# Altium project MAX14871_DC_Motor_Driver.PrjPcb (part 1 of 3)
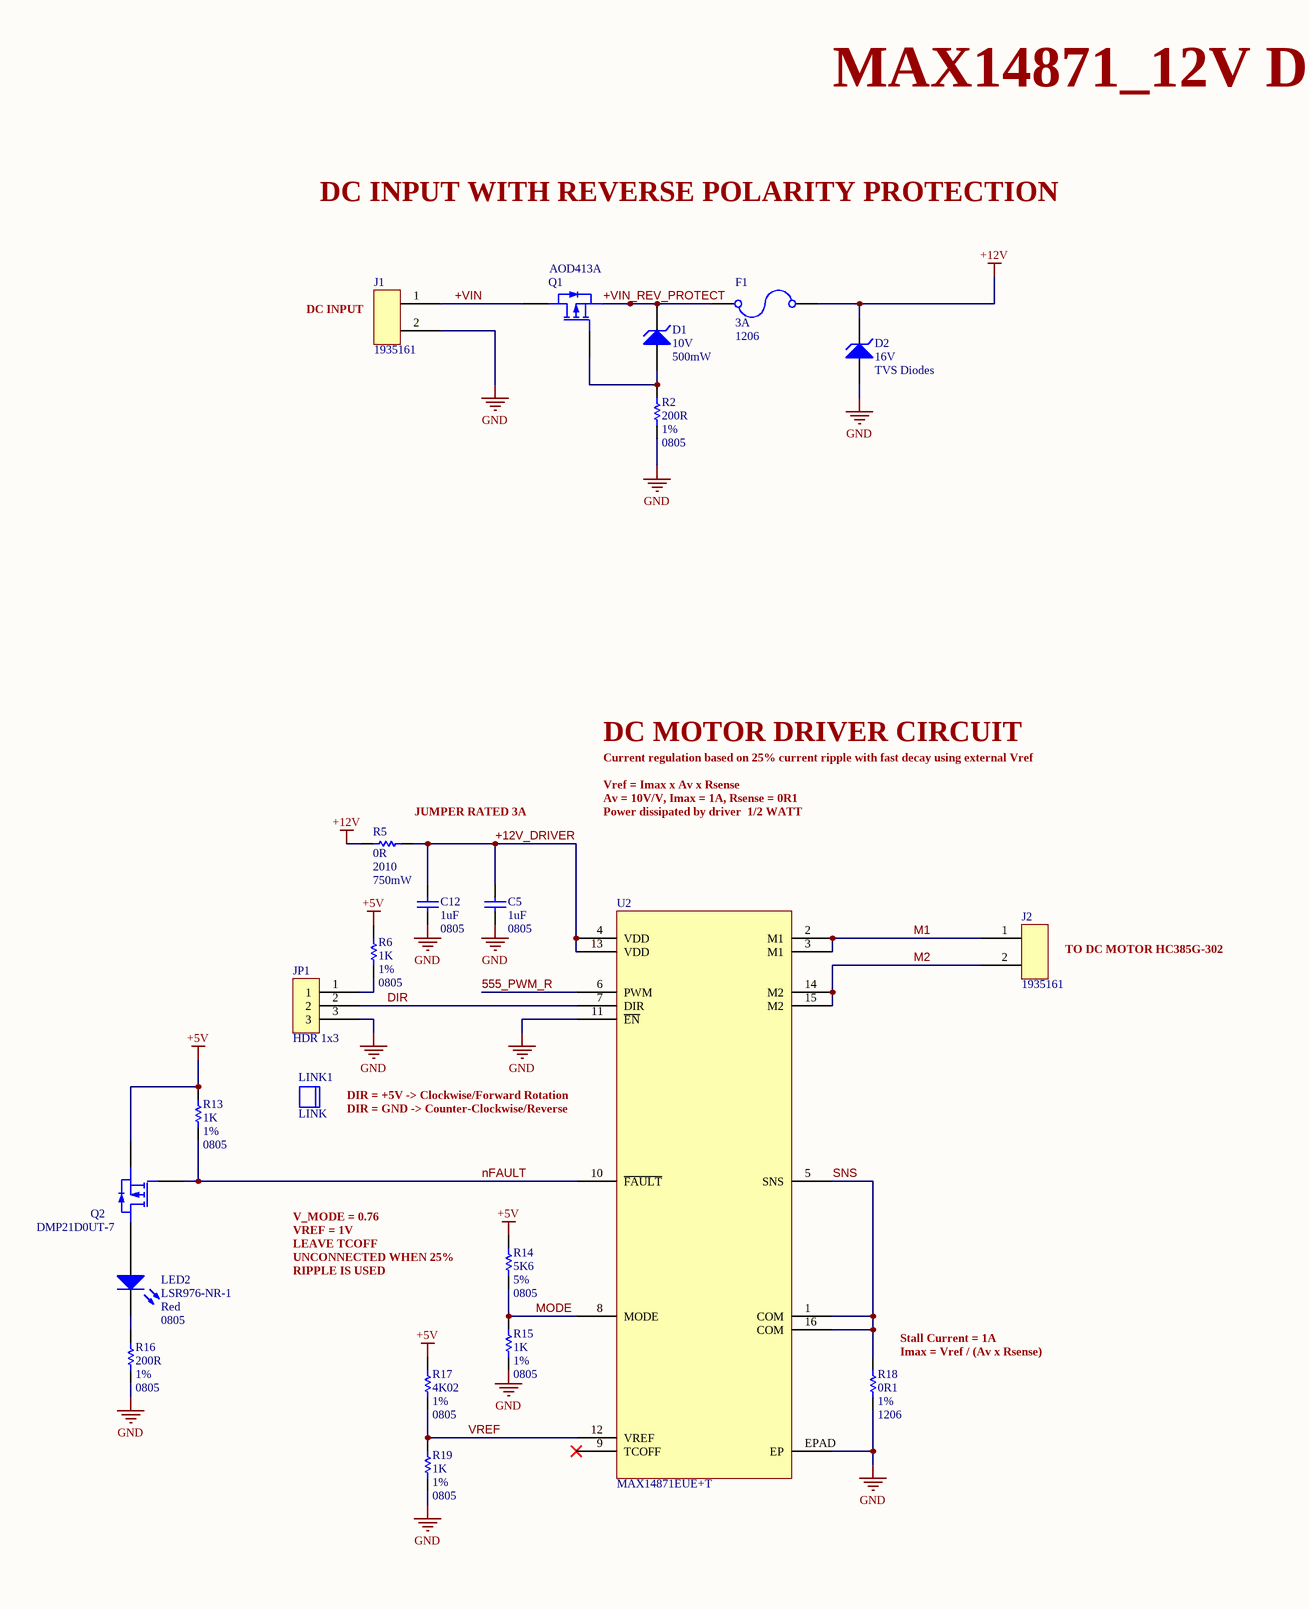
[diagram p0: 14871_Schematic.SchDoc, left]
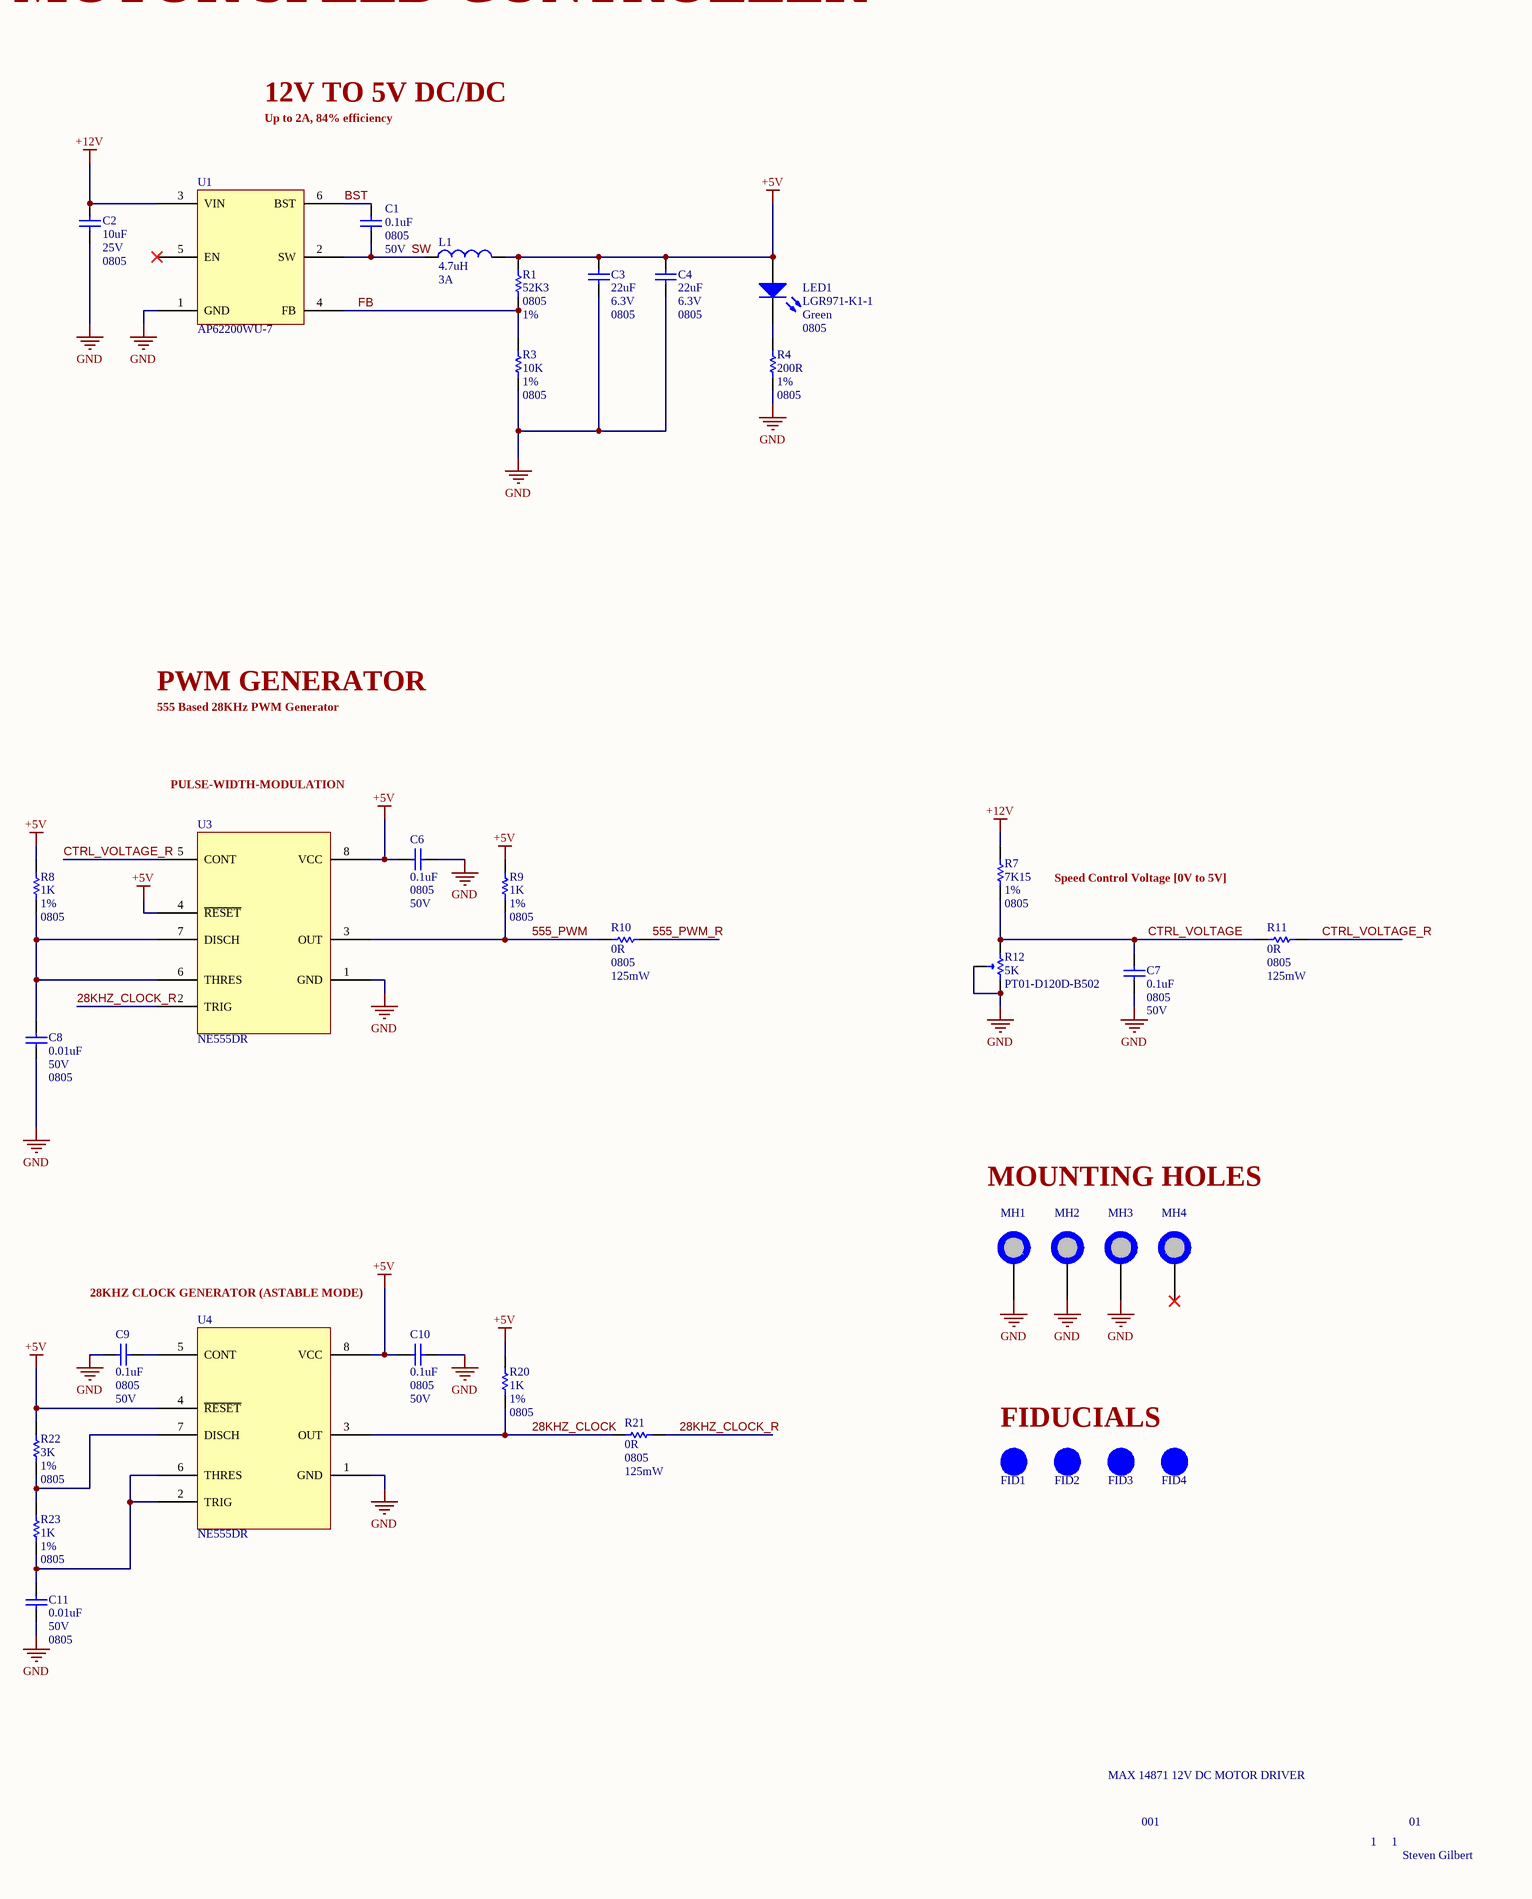
[diagram p1: 14871_Schematic.SchDoc, right]
1 sheet, 59 parts. Net scope: global (net labels, ports and power ports of the same name join across sheets).
Board file: 14871_V1I1.PcbDoc

## Sheet 14871_Schematic.SchDoc
size A2

### Parts
C1  0.1uF  Case Code (Imperial): 0805  Voltage Rating (DC): 50V  [C0805]
C2  10uF  Voltage Rating (DC): 25V  Case/Package: 0805  [C0805]
C3  22uF  Voltage Rating: 6.3V  Case/Package: 0805  [C0805]
C4  22uF  Voltage Rating: 6.3V  Case/Package: 0805  [C0805]
C5  1uF  Case/Package: 0805  [C0805]
C6  0.1uF  Case Code (Imperial): 0805  Voltage Rating (DC): 50V  [C0805]
C7  0.1uF  Case Code (Imperial): 0805  Voltage Rating (DC): 50V  [C0805]
C8  0.01uF  Voltage Rating: 50V  Case/Package: 0805  [C0805]
C9  0.1uF  Case Code (Imperial): 0805  Voltage Rating (DC): 50V  [C0805]
C10  0.1uF  Case Code (Imperial): 0805  Voltage Rating (DC): 50V  [C0805]
C11  0.01uF  Voltage Rating: 50V  Case/Package: 0805  [C0805]
C12  1uF  Case/Package: 0805  [C0805]
D1  10V  Max Power Dissipation: 500mW  [SOD123_Zener]
D2  16V  Category: TVS Diodes  [TVS_SOD123FL]
F1  3A  Case/Package: 1206  [FUSE1206]
FID1  FID_1MM  [FID_40X120D]  (value not drawn)  (no BOM)
FID2  FID_1MM  [FID_40X120D]  (value not drawn)  (no BOM)
FID3  FID_1MM  [FID_40X120D]  (value not drawn)  (no BOM)
FID4  FID_1MM  [FID_40X120D]  (value not drawn)  (no BOM)
J1  1935161  [1935161]
J2  1935161  [1935161]
JP1  HDR 1x3  [HDR_1x3_2.54mm]
L1  4.7uH  Max DC Current: 3A  [NR6028T4R7M]
LED1  LGR971-K1-1  Illumination Color: Green  Case/Package: 0805  [LED0805 - Green]
LED2  LSR976-NR-1  Illumination Color: Red  Case/Package: 0805  [LED0805]
LINK1  LINK  (mechanical)
MH1  MH_7.4MMC_3.2MMD  [MH_7.4MMC_3.2MMD]  (value not drawn)  (no BOM)
MH2  MH_7.4MMC_3.2MMD  [MH_7.4MMC_3.2MMD]  (value not drawn)  (no BOM)
MH3  MH_7.4MMC_3.2MMD  [MH_7.4MMC_3.2MMD]  (value not drawn)  (no BOM)
MH4  MH_7.4MMNC_3.2MMD  [MH_7.4MMD_3.2MMD_NON_COPPER_NPTH]  (value not drawn)  (no BOM)
Q1  AOD413A  [TO252]
Q2  DMP21D0UT-7  [SOT523]
R1  52K3  Case/Package: 0805  Tolerance: 1%  [R0805]
R2  200R  Tolerance: 1%  Case/Package: 0805  [R0805]
R3  10K  Tolerance: 1%  Case/Package: 0805  [R0805]
R4  200R  Tolerance: 1%  Case/Package: 0805  [R0805]
R5  0R  Case/Package: 2010  Power Rating: 750mW  [R2010]
R6  1K  Tolerance: 1%  Case/Package: 0805  [R0805]
R7  7K15  Tolerance: 1%  Case/Package: 0805  [R0805]
R8  1K  Tolerance: 1%  Case/Package: 0805  [R0805]
R9  1K  Tolerance: 1%  Case/Package: 0805  [R0805]
R10  0R  Case/Package: 0805  Max Power Dissipation: 125mW  [R0805]
R11  0R  Case/Package: 0805  Max Power Dissipation: 125mW  [R0805]
R12  5K  [TRIM_PT01-D120D-B502]
R13  1K  Tolerance: 1%  Case/Package: 0805  [R0805]
R14  5K6  Resistance Tolerance: 5%  Case/Package: 0805  [R0805]
R15  1K  Tolerance: 1%  Case/Package: 0805  [R0805]
R16  200R  Tolerance: 1%  Case/Package: 0805  [R0805]
R17  4K02  Tolerance: 1%  Case/Package: 0805  [R0805]
R18  0R1  Tolerance: 1%  Package: 1206  [R1206]
R19  1K  Tolerance: 1%  Case/Package: 0805  [R0805]
R20  1K  Tolerance: 1%  Case/Package: 0805  [R0805]
R21  0R  Case/Package: 0805  Max Power Dissipation: 125mW  [R0805]
R22  3K  Tolerance: 1%  Case/Package: 0805  [R0805]
R23  1K  Tolerance: 1%  Case/Package: 0805  [R0805]
U1  AP62200WU-7  [TSOT26]
U2  MAX14871EUE+T  [21-0108_U16E+3_MXM-M]
U3  NE555DR  [8-SOIC]
U4  NE555DR  [8-SOIC]

### Nets
+5V: C3.2 C4.2 C6.1 C10.1 L1.2 LED1.A Q2.S R1.1 R6.1 R8.1 R9.1 R13.1 R14.1 R17.1 R20.1 R22.1 U3.4(~{RESET}) U3.8(VCC) U4.4(~{RESET}) U4.8(VCC)
+12V: C2.2 D2.K F1.2 R5.2 R7.1 U1.3(VIN)
GND: C2.1 C3.1 C4.1 C5.1 C6.2 C7.1 C8.1 C9.1 C10.2 C11.1 C12.1 D2.A J1.2 JP1.3 MH1.1 MH2.1 MH3.1 R2.2 R3.2 R4.2 R12.1 R12.2 R15.2 R16.2 R18.2 R19.2 U1.1(GND) U2.11(~{EN}) U2.EPAD(EP) U3.1(GND) U4.1(GND)
28KHZ_CLOCK: R20.2 R21.2 U4.3(OUT)
28KHZ_CLOCK_R: R21.1 U3.2(TRIG)
555_PWM: R9.2 R10.2 U3.3(OUT)
555_PWM_R: R10.1 U2.6(PWM)
+12V_DRIVER: C5.2 C12.2 R5.1 U2.4(VDD) U2.13(VDD)
+VIN: J1.1 Q1.D
+VIN_REV_PROTECT: D1.K F1.1 Q1.S
BST: C1.2 U1.6(BST)
CTRL_VOLTAGE: C7.2 R7.2 R11.2 R12.3
CTRL_VOLTAGE_R: R11.1 U3.5(CONT)
DIR: JP1.2 U2.7(DIR)
FB: R1.2 R3.1 U1.4(FB)
M1: J2.1 U2.2(M1) U2.3(M1)
M2: J2.2 U2.14(M2) U2.15(M2)
MODE: R14.2 R15.1 U2.8(MODE)
nFAULT: Q2.G R13.2 U2.10(~{FAULT})
SNS: R18.1 U2.1(COM) U2.5(SNS) U2.16(COM)
SW: C1.1 L1.1 U1.2(SW)
VREF: R17.2 R19.1 U2.12(VREF)
NetC8_2: C8.2 R8.2 U3.6(THRES) U3.7(DISCH)
NetC9_2: C9.2 U4.5(CONT)
NetC11_2: C11.2 R23.2 U4.2(TRIG) U4.6(THRES)
NetD1_A: D1.A Q1.G R2.1
NetJP1_1: JP1.1 R6.2
NetLED1_K: LED1.K R4.1
NetLED2_A: LED2.A Q2.D
NetLED2_K: LED2.K R16.1
NetR22_2: R22.2 R23.1 U4.7(DISCH)

Not connected (* = marked no-connect by the designer): MH4 1*; U1 5(EN)*; U2 9(TCOFF)*

### Notes on the sheet
- MAX14871_12V DC MOTOR SPEED CONTROLLER
- DC INPUT WITH REVERSE POLARITY PROTECTION
- 12V TO 5V DC/DC
- Up to 2A, 84% efficiency
- (near J1) DC INPUT
- DC MOTOR DRIVER CIRCUIT
- (near R5) JUMPER RATED 3A
- PWM GENERATOR
- 555 Based 28KHz PWM Generator
- Current regulation based on 25% current ripple with fast decay using external Vref
  Vref = Imax x Av x Rsense
  Av = 10V/V, Imax = 1A, Rsense = 0R1
  Power dissipated by driver  1/2 WATT
- PULSE-WIDTH-MODULATION
- (near J2) TO DC MOTOR HC385G-302
- Speed Control Voltage [0V to 5V]
- DIR = +5V -> Clockwise/Forward Rotation
  DIR = GND -> Counter-Clockwise/Reverse
- V_MODE = 0.76
  VREF = 1V
  LEAVE TCOFF UNCONNECTED WHEN 25% RIPPLE IS USED
- MOUNTING HOLES
- (near R18) Stall Current = 1A
  Imax = Vref / (Av x Rsense)
- 28KHZ CLOCK GENERATOR (ASTABLE MODE)
- FIDUCIALS
- MAX 14871 12V DC MOTOR DRIVER
- 001
- 1
- Steven Gilbert
- 01